# Altium schematic sheet Port.SchDoc
size A4; SheetNumber: 3; SheetTotal: 5
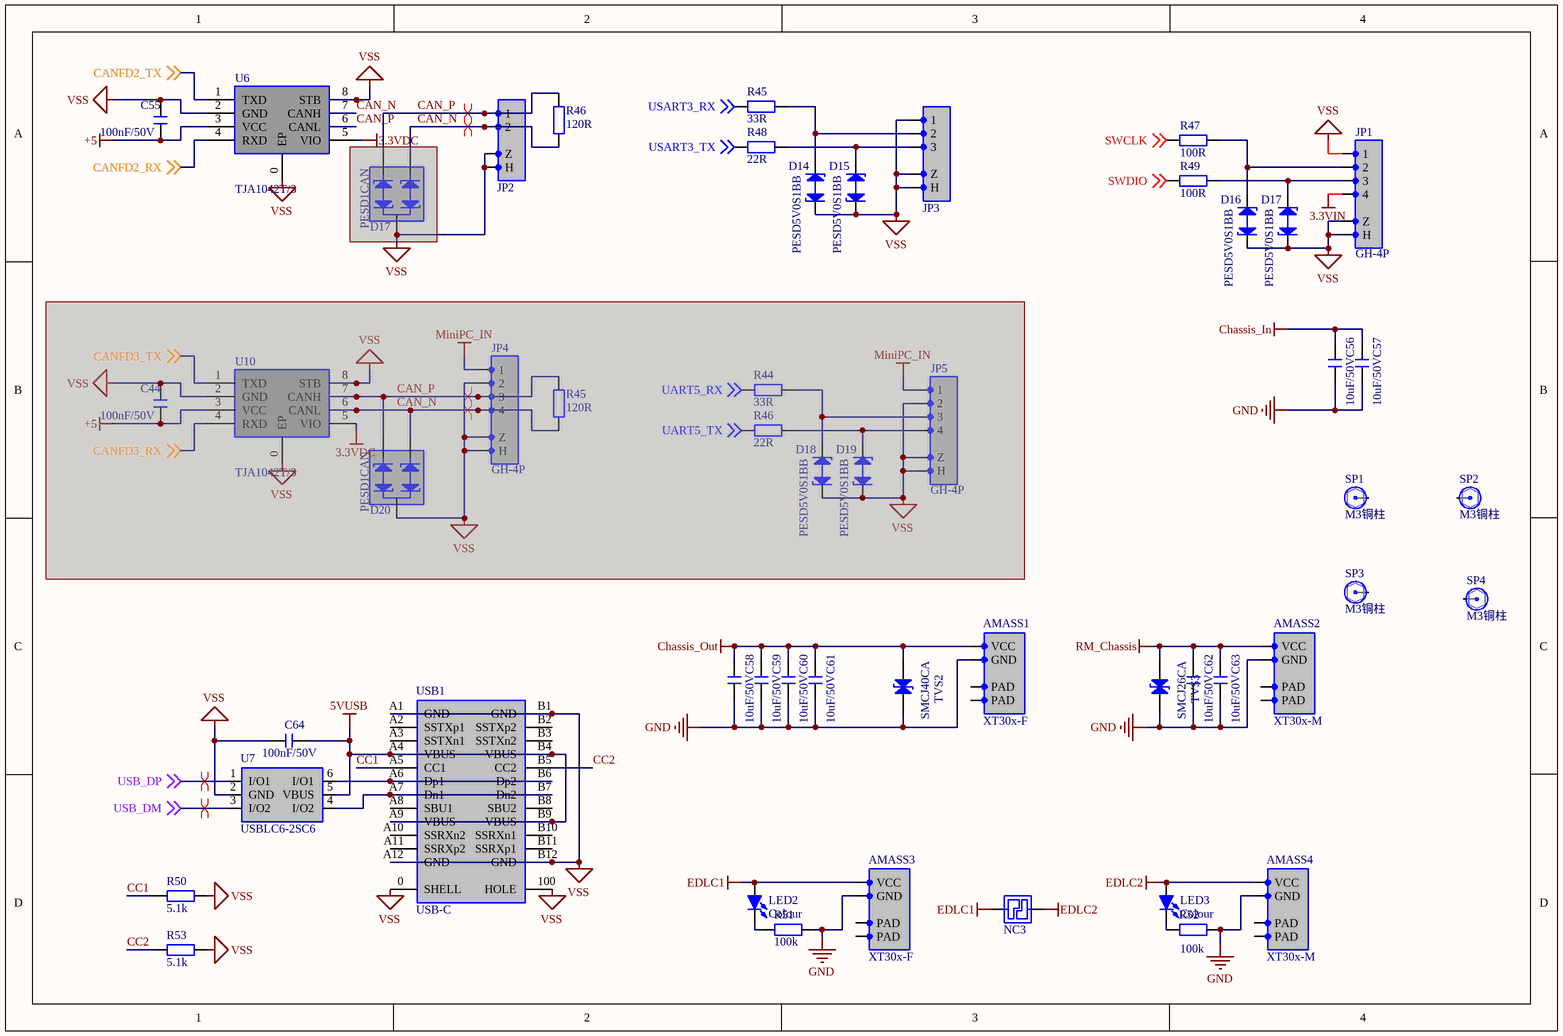
[diagram p0: Port.SchDoc]

## Parts
(Parts that share a designator on the sheet are numbered #1, #2 ... from top to bottom, then left to right.)
AMASS1  XT30x-F  [XT30U-F]
AMASS2  XT30x-M  [XT30U-M]
AMASS3  XT30x-F  [XT30U-F]
AMASS4  XT30x-M  [XT30U-M]
C44  100nF/50V  [C 0603_L]  (masked out: inside a compile mask, not in the netlist)
C55  100nF/50V  [C 0603_L]
C56  10uF/50V  [C 1206_L]
C57  10uF/50V  [C 1206_L]
C58  10uF/50V  [C 1206_L]
C59  10uF/50V  [C 1206_L]
C60  10uF/50V  [C 1206_L]
C61  10uF/50V  [C 1206_L]
C62  10uF/50V  [C 1206_L]
C63  10uF/50V  [C 1206_L]
C64  100nF/50V  [C 0603_L]
D14  PESD5V0S1BB  [SOD-523]
D15  PESD5V0S1BB  [SOD-523]
D16  PESD5V0S1BB  [SOD-523]
D17#1  PESD1CAN  [SOT23-3L]  (masked out: inside a compile mask, not in the netlist)
D17#2  PESD5V0S1BB  [SOD-523]
D18  PESD5V0S1BB  [SOD-523]  (masked out: inside a compile mask, not in the netlist)
D19  PESD5V0S1BB  [SOD-523]  (masked out: inside a compile mask, not in the netlist)
D20  PESD1CAN  [SOT23-3L]  (masked out: inside a compile mask, not in the netlist)
JP1  GH-4P  [GH 1.25-LS-4P]
JP2  HDR-1X2  [GH 1.25-LS-2P]  (value not drawn)
JP3  HDR-1X3  [GH 1.25-LS-3P]  (value not drawn)
JP4  GH-4P  [GH 1.25-LS-4P]  (masked out: inside a compile mask, not in the netlist)
JP5  GH-4P  [GH 1.25-LS-4P]  (masked out: inside a compile mask, not in the netlist)
LED2  Colour  [LED 0603R]
LED3  Colour  [LED 0603R]
NC3  NODE  [NODE-3]  (value not drawn)
R44  33R  [R 0603_L]  (masked out: inside a compile mask, not in the netlist)
R45#1  33R  [R 0603_L]
R45#2  120R  [R 0603_L]  (masked out: inside a compile mask, not in the netlist)
R46#1  120R  [R 0603_L]
R46#2  22R  [R 0603_L]  (masked out: inside a compile mask, not in the netlist)
R47  100R  [R 0603_L]
R48  22R  [R 0603_L]
R49  100R  [R 0603_L]
R50  5.1k  [R 0603_L]
R51  100k  [R 0603_L]
R52  100k  [R 0603_L]
R53  5.1k  [R 0603_L]
SP1  M3铜柱  [M3x4+6_N]
SP2  M3铜柱  [M3x4+6_N]
SP3  M3铜柱  [M3x4+6_N]
SP4  M3铜柱  [M3x4+6_N]
TVS2  SMCJ40CA  [SMC]
TVS3  SMCJ26CA  [SMC]
U6  TJA1042T/3  [HVSON8_N]
U7  USBLC6-2SC6  [SOT23-6L]
U10  TJA1042T/3  [HVSON8_N]  (masked out: inside a compile mask, not in the netlist)
USB1  USB-C  [USB-C/S_B]

## Nets
3.3VDC: U6.5(VIO)
3.3VIN: JP1.4
5VUSB: C64.1 U7.5(VBUS) USB1.A4(VBUS) USB1.A9(VBUS) USB1.B4(VBUS) USB1.B9(VBUS)
+5: C55.1 U6.3(VCC)
Chassis_In: C56.1 C57.1
Chassis_Out: AMASS1.1(VCC) C58.1 C59.1 C60.1 C61.1 TVS2.1(A)
EDLC1: AMASS3.1(VCC) LED2.1(A) NC3.1
EDLC2: AMASS4.1(VCC) LED3.1(A) NC3.2
GND: AMASS1.2(GND) AMASS2.2(GND) AMASS3.2(GND) AMASS4.2(GND) C56.2 C57.2 C58.2 C59.2 C60.2 C61.2 C62.2 C63.2 R51.2 R52.2 TVS2.2(K) TVS3.2(K)
RM_Chassis: AMASS2.1(VCC) C62.1 C63.1 TVS3.1(A)
VSS: C55.2 C64.2 D14.2(K) D15.2(K) D16.2(K) D17#2.2(K) JP1.0(Z) JP1.1 JP1.100(H) JP3.0(Z) JP3.1 JP3.100(H) R50.2 R53.2 U6.0(EP) U6.2(GND) U6.8(STB) U7.2(GND) USB1.0(SHELL) USB1.100(HOLE) USB1.A1(GND) USB1.A12(GND) USB1.B1(GND) USB1.B12(GND)
CAN_N: JP2.2 R46#1.1 U6.7(CANH)
CAN_P: JP2.1 R46#1.2 U6.6(CANL)
CANFD2_RX: U6.4(RXD) ; off-sheet CANFD2_RX
CANFD2_TX: U6.1(TXD) ; off-sheet CANFD2_TX
CC1: R50.1 USB1.A5(CC1)
CC2: R53.1 USB1.B5(CC2)
SWCLK: R47.1 ; off-sheet SWCLK
SWDIO: R49.1 ; off-sheet SWDIO
USART3_RX: R45#1.1 ; off-sheet USART3_RX
USART3_TX: R48.1 ; off-sheet USART3_TX
USB_DM: U7.3(I/O2) ; off-sheet USB_DM
USB_DP: U7.1(I/O1) ; off-sheet USB_DP
NetD14_1: D14.1(A) JP3.2 R45#1.2
NetD15_1: D15.1(A) JP3.3 R48.2
NetD16_1: D16.1(A) JP1.2 R47.2
NetD17#2_1: D17#2.1(A) JP1.3 R49.2
NetJP2_0: JP2.0(Z) JP2.100(H)
NetLED2_2: LED2.2(K) R51.1
NetLED3_2: LED3.2(K) R52.1
NetU7_4: U7.4(I/O2) USB1.A7(Dn1) USB1.B7(Dn2)
NetU7_6: U7.6(I/O1) USB1.A6(Dp1) USB1.B6(Dp2)

Not connected (* = marked no-connect by the designer): AMASS1 0(PAD) 100(PAD); AMASS2 0(PAD) 100(PAD); AMASS3 0(PAD) 100(PAD); AMASS4 0(PAD) 100(PAD); SP1 1; SP2 1; SP3 1; SP4 1; USB1 A2(SSTXp1) A3(SSTXn1) A8(SBU1) A10(SSRXn2) A11(SSRXp2) B2(SSTXp2) B3(SSTXn2) B8(SBU2) B10(SSRXn1) B11(SSRXp1)

## Layout directives
differential pair: (no net found under the mark), CAN_N, CAN_P, USB_DM, USB_DP

## Library data of the parts
AMASS1-AMASS4 = XT30: Amass防打火电源接口，XT30系列
C44 C55-C64 = C: 无极性贴片电容; 版权归属: 源创客; BOM名称: 无极性贴片电容; 学习资源: www.ooocke.com
D14-D16 D17#2 D18 D19 = ESD: 双向静电放电二极管
D17#1 D20 = ESD_2P: CAN总线双向静电放电二极管
JP1 JP4 JP5 = Header 4: 4P接插件; 版权归属: 源创客; BOM名称: 4P接插件; 学习资源: www.ooocke.com
JP2 = Header 2: 2P接插件; 版权归属: 源创客; BOM名称: 2P接插件; 学习资源: www.ooocke.com
JP3 = Header 3: 3P接插件; 版权归属: 源创客; BOM名称: 3P接插件; 学习资源: www.ooocke.com
LED2 LED3 = LED-SMD: 贴片LED; 版权归属: 源创客; BOM名称: 贴片LED; 学习资源: www.ooocke.com
NC3 = NODE: 大电流节点
R44 R45#1 R45#2 R46#1 R46#2 R47-R53 = R: 贴片电阻; 版权归属: 源创客; BOM名称: 贴片电阻; 学习资源: www.ooocke.com
SP1-SP4 = 铜柱加头大焊盘: 铜柱; 版权归属: 源创客; BOM名称: 铜柱; 学习资源: www.ooocke.com
TVS2 TVS3 = TVS: 瞬态电压抑制二极管; 版权归属: 源创客; BOM名称: 瞬态电压抑制二极管; 学习资源: www.ooocke.com
U6 U10 = TJA1042T/3: CAN-FD收发器
U7 = USBLC6-2SC6: USBESD保护器TVS陈列; 版权归属: 源创客; 学习资源: www.ooocke.com
USB1 = USB-C/S: USB-C型母接口; 版权归属: 源创客; BOM名称: USB-C型母接口; 学习资源: www.ooocke.com